# EAGLE design tres_chepes (EAGLE 6.5.0)
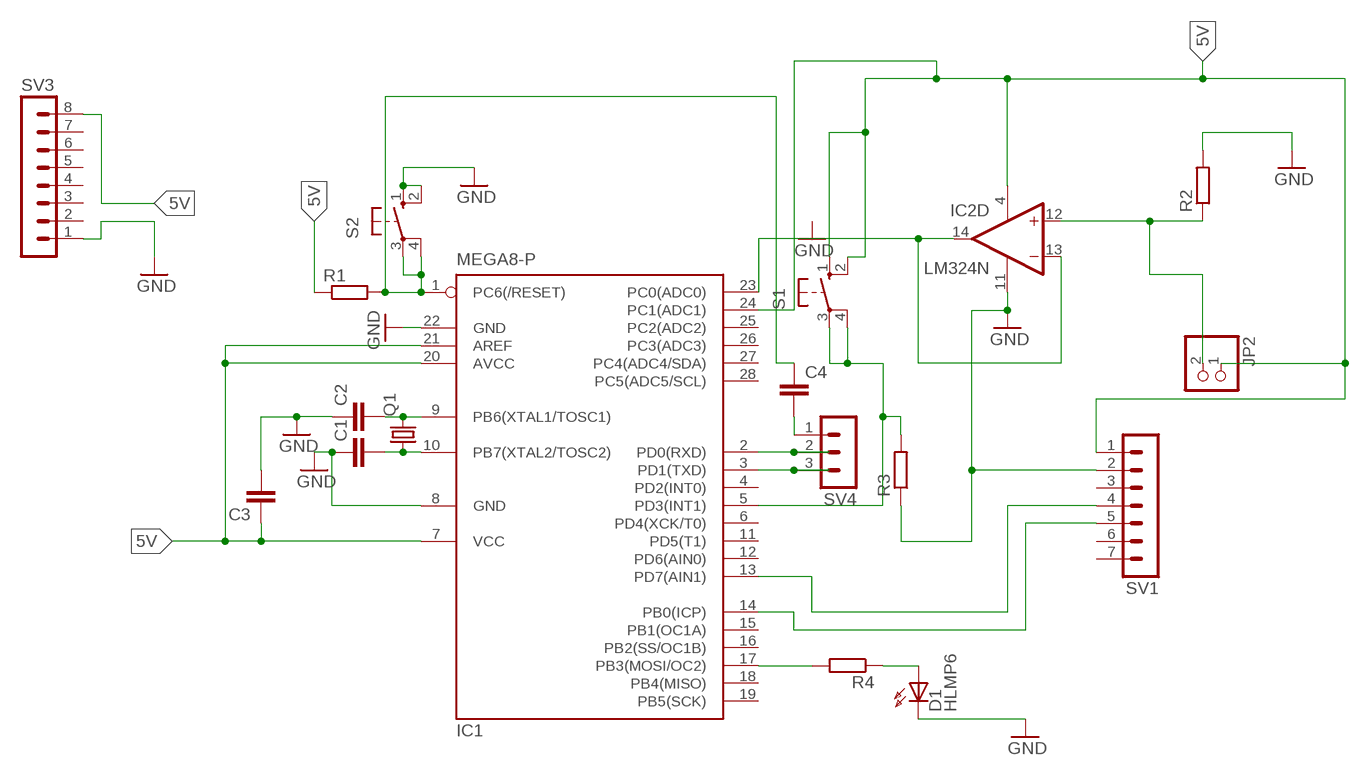
[diagram p0: schematic, sheet 1]

## Parts
C1  C2,5-3  [C2.5-3]
C2  C2,5-3  [C2.5-3]
C3  C2,5-3  [C2.5-3]
C4  C-EU025-024X044  [C025-024X044]
D1  HLMP6  [HLMP6]
IC1  MEGA8-P  [DIL28-3]
IC2  LM324N  [DIL14]
JP2  PINHD-1X2  [1X02]
Q1  CRYSTALTC26V  [TC26V]
R1  R-EU_0204/5  [0204/5]
R2  R-EU_0204/5  [0204/5]
R3  R-EU_0204/5  [0204/5]
R4  R-EU_0204/5  [0204/5]
S1  10-XX  [B3F-10XX]
S2  10-XX  [B3F-10XX]
SV1  MA07-1  [MA07-1]
SV3  MA08-1W  [MA08-1W]
SV4  MA03-1  [MA03-1]

## Nets
5V: C3.1 IC1.7(VCC) IC1.20(AVCC) IC1.21(AREF) IC1.24(PC1(ADC1)) IC2.4(P:V+) JP2.1 R1.1 S1.1(S) S1.2(S1) SV1.1 SV3.8
GND: C1.1 C2.1 C3.2 D1.K IC1.8(GND) IC1.22(GND) IC2.11(P:V-) R2.2 R3.1 S2.1(S) S2.2(S1) SV1.2 SV3.1
N$1: IC2.12(D:+IN) JP2.2 R2.1
N$2: C4.2 SV4.1
N$3: IC1.17(PB3(MOSI/OC2)) R4.2
N$4: IC1.5(PD3(INT1)) R3.2 S1.3(P) S1.4(P1)
N$5: IC1.3(PD1(TXD)) SV4.3
N$6: D1.A R4.1
N$7: IC1.2(PD0(RXD)) SV4.2
N$11: IC1.13(PD7(AIN1)) SV1.4
N$12: IC1.14(PB0(ICP)) SV1.5
N$14: C2.2 IC1.9(PB6(XTAL1/TOSC1)) Q1.2
N$15: C1.2 IC1.10(PB7(XTAL2/TOSC2)) Q1.1
N$16: C4.1 IC1.1(PC6(/RESET)) R1.2 S2.3(P) S2.4(P1)
N$18: IC1.23(PC0(ADC0)) IC2.13(D:-IN) IC2.14(D:OUT)
Unconnected: IC1.4(PD2(INT0)) IC1.6(PD4(XCK/T0)) IC1.11(PD5(T1)) IC1.12(PD6(AIN0)) IC1.15(PB1(OC1A)) IC1.16(PB2(SS/OC1B)) IC1.18(PB4(MISO)) IC1.19(PB5(SCK)) IC1.25(PC2(ADC2)) IC1.26(PC3(ADC3)) IC1.27(PC4(ADC4/SDA)) IC1.28(PC5(ADC5/SCL)) IC2.1(A:OUT) IC2.2(A:-IN) IC2.3(A:+IN) IC2.5(B:+IN) IC2.6(B:-IN) IC2.7(B:OUT) IC2.8(C:OUT) IC2.9(C:-IN) IC2.10(C:+IN) SV1.3 SV1.6 SV1.7 SV3.2 SV3.3 SV3.4 SV3.5 SV3.6 SV3.7

## Library data of the parts
C1-C3 = capacitor-wima:C: CAPACITOR naming: grid - package width
C4 = rcl:C-EU: CAPACITOR, European symbol
D1 = display-hp:HLMP6: LED 2mm horizontal; MF: AGILENT TECHNOLOGIES; MPN: HLMP-6500; OC_FARNELL: 1652490; OC_NEWARK: 40K0088
IC1 = atmel:MEGA8-P: MICROCONTROLLER 8 Kbytes FLASH, 1 kbytes SRAM, 512 bytes EEPROM, USART, 4-channel 10 bit ADC, 2-channel 8 bit ADC Pin compatible with Atmega48, ATMega88, ATMega168 Source: avr.lbr; OC_FARNELL: unknown; OC_NEWARK: unknown
IC2 = linear:LM324: OP AMP
JP2 = pinhead:PINHD-1X2: PIN HEADER
Q1 = crystal:CRYSTAL: CRYSTAL; OC_FARNELL: unknown; OC_NEWARK: unknown
R1-R4 = rcl:R-EU_: RESISTOR, European symbol
S1 S2 = switch-omron:10-XX: OMRON SWITCH; MPN: B3F-1000; OC_FARNELL: 176432; OC_NEWARK: 36M3542
SV1 = con-lstb:MA07-1: PIN HEADER; OC_FARNELL: unknown; OC_NEWARK: unknown
SV3 = con-lstb:MA08-1W: PIN HEADER; OC_FARNELL: unknown; OC_NEWARK: unknown
SV4 = con-lstb:MA03-1: PIN HEADER; OC_FARNELL: unknown; OC_NEWARK: unknown

## Board
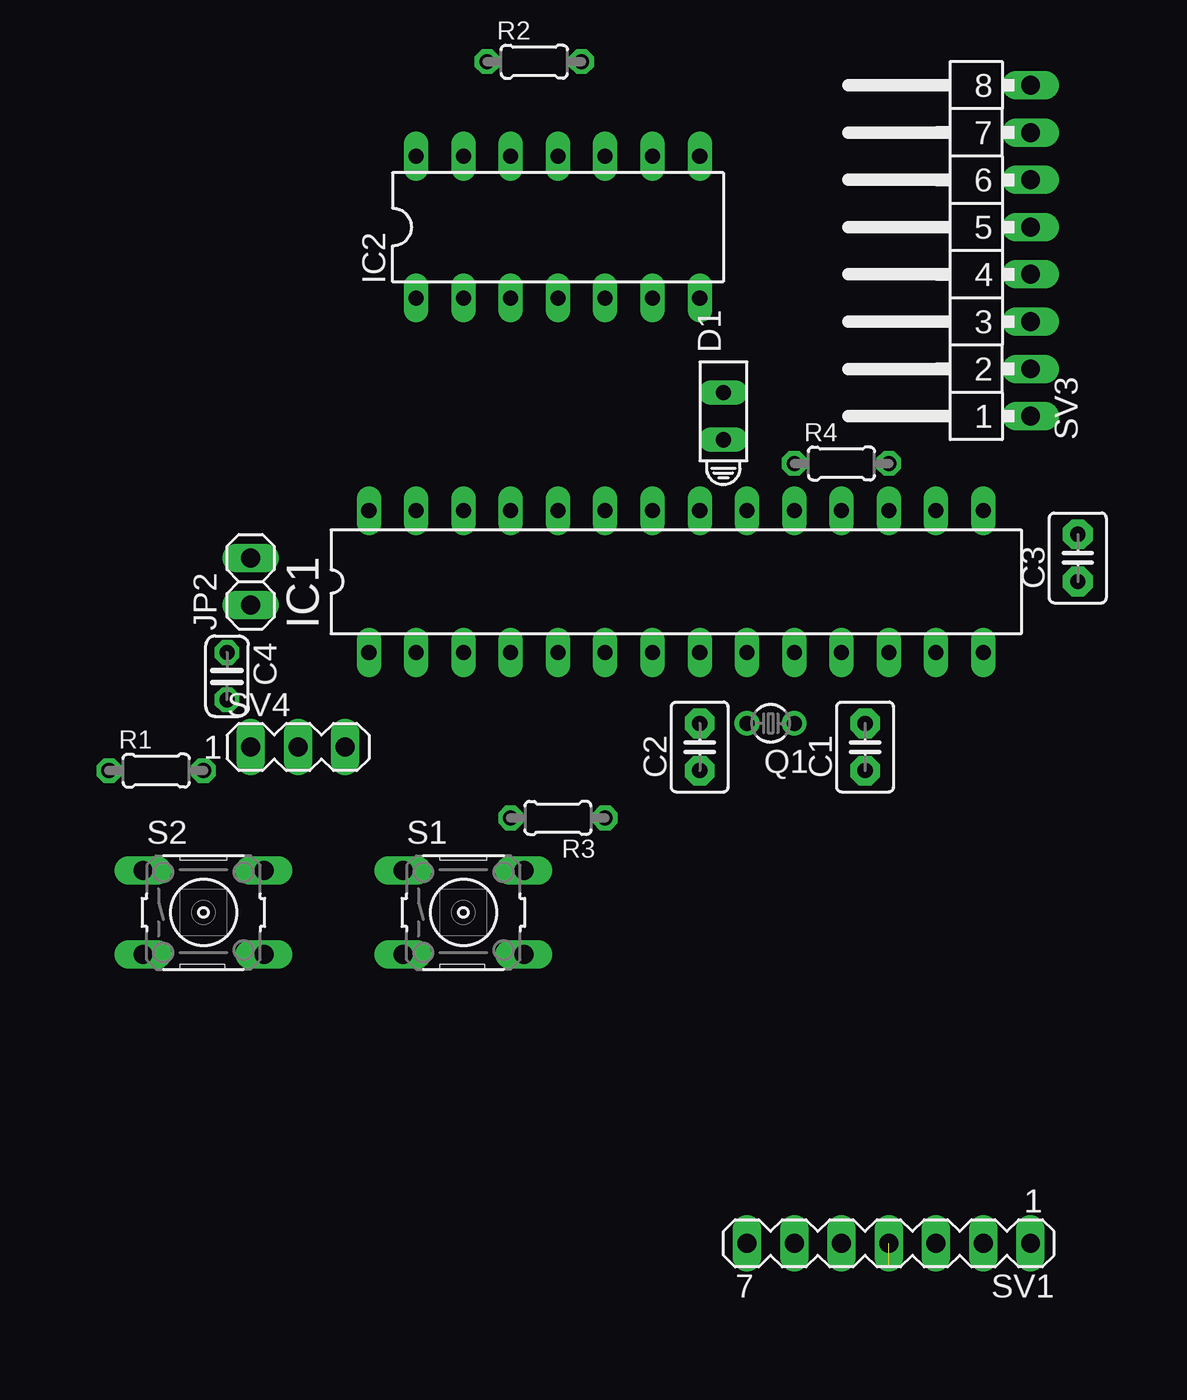
[diagram p1: board, top side]
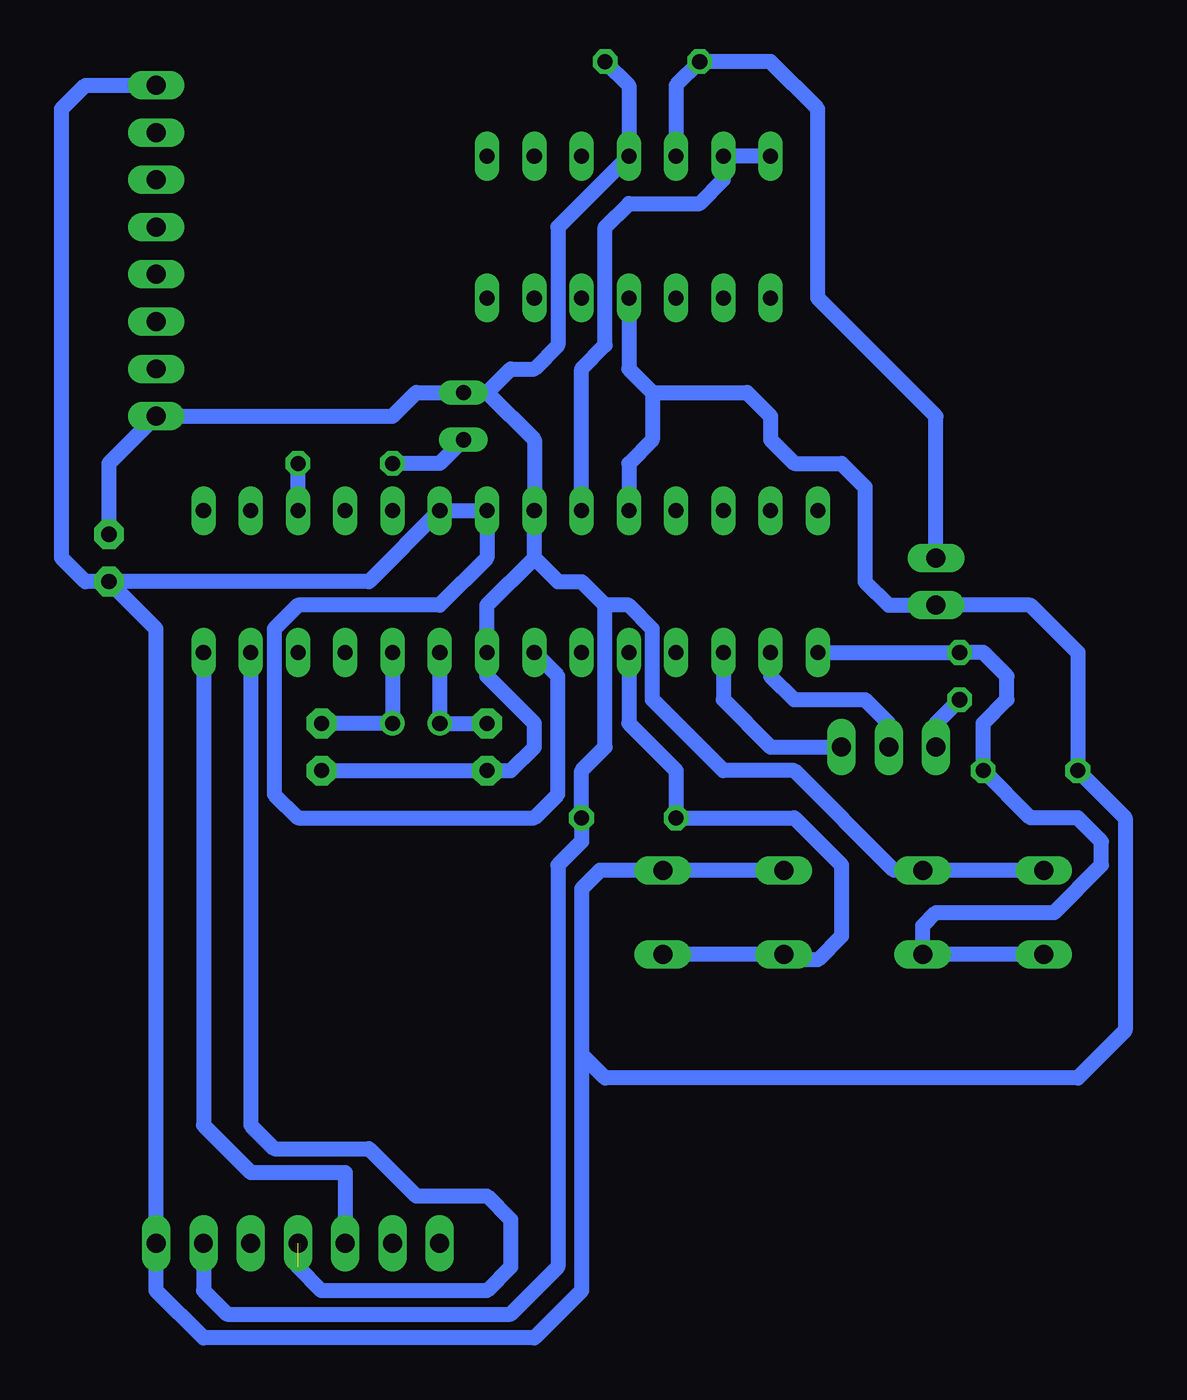
[diagram p2: board, bottom side, seen from below]

No outline drawn. Coordinates in mm, seen from the top.
Copper layers (1*16): Top 0.035mm / dielectric 1.5mm / Bottom 0.035mm
Design rules "default": minimum track width 10mil, minimum drill 24mil, track to track 8mil, track to pad 8mil, pad to pad 8mil, via to via 8mil, smd to smd 8mil, copper to edge 40mil, drill to drill 8mil, minimum pad ring 10mil, minimum via ring 8mil, stop-mask expansion 4mil, vias tented up to drill 0mil, thermal gap 10mil

### Footprints (pad centres in the part's own frame; a part is rotated, then mirrored left to right if it is on the bottom)
C2.5-3 = drill 0.813 pad 1.6 octagon: 1 -1.27,0; 2 1.27,0
C025-024X044 = drill 0.813 octagon: 1 -1.27,0; 2 1.27,0
HLMP6 = drill 0.813 long: A -1.27,0; K 1.27,0
DIL28-3 = drill 0.813 long: 1 -16.51,-3.81; 2 -13.97,-3.81; 3 -11.43,-3.81; 4 -8.89,-3.81; 5 -6.35,-3.81; 6 -3.81,-3.81; 7 -1.27,-3.81; 8 1.27,-3.81; 9 3.81,-3.81; 10 6.35,-3.81; 11 8.89,-3.81; 12 11.43,-3.81; 13 13.97,-3.81; 14 16.51,-3.81; 15 16.51,3.81; 16 13.97,3.81; 17 11.43,3.81; 18 8.89,3.81; 19 6.35,3.81; 20 3.81,3.81; 21 1.27,3.81; 22 -1.27,3.81; 23 -3.81,3.81; 24 -6.35,3.81; 25 -8.89,3.81; 26 -11.43,3.81; 27 -13.97,3.81; 28 -16.51,3.81
DIL14 = drill 0.813 long: 1 -7.62,-3.81; 2 -5.08,-3.81; 3 -2.54,-3.81; 4 0,-3.81; 5 2.54,-3.81; 6 5.08,-3.81; 7 7.62,-3.81; 8 7.62,3.81; 9 5.08,3.81; 10 2.54,3.81; 11 0,3.81; 12 -2.54,3.81; 13 -5.08,3.81; 14 -7.62,3.81
1X02 = drill 1.016 long: 1 -1.27,0; 2 1.27,0
TC26V = drill 0.813: 1 -1.27,0; 2 1.27,0
0204/5 = drill 0.813 octagon: 1 -2.54,0; 2 2.54,0
B3F-10XX = drill 1.016 long: 1 -3.251,2.261; 2 3.251,2.261; 3 -3.251,-2.261; 4 3.251,-2.261
MA07-1 = drill 1.016 long: 1 -7.62,0; 2 -5.08,0; 3 -2.54,0; 4 0,0; 5 2.54,0; 6 5.08,0; 7 7.62,0
MA08-1W = drill 1.016 long: 1 -8.89,0; 2 -6.35,0; 3 -3.81,0; 4 -1.27,0; 5 1.27,0; 6 3.81,0; 7 6.35,0; 8 8.89,0
MA03-1 = drill 1.016 long: 1 -2.54,0; 2 0,0; 3 2.54,0

### Placement (x,y rotation side)
C1  40.64,27.94 90 top
C2  31.75,27.94 90 top
C3  52.07,38.1 90 top
C4  6.35,31.75 270 top
D1  33.02,45.72 90 top
IC1  30.48,36.83 0 top
IC2  24.13,55.88 0 top
JP2  7.62,36.83 90 top
Q1  35.56,29.21 180 top
R1  2.54,26.67 0 top
R2  22.86,64.77 0 top
R3  24.13,24.13 180 top
R4  39.37,43.18 0 top
S1  19.05,19.05 0 top
S2  5.08,19.05 0 top
SV1  41.91,1.27 180 top
SV3  49.53,54.61 90 top
SV4  10.16,27.94 0 top

### Tracks (layer width: path | path; a pad name or v marks a point on that pad's centre or on a via)
5V
  Bottom 0.813: C3.1 38.1,36.83 IC1.20 IC1.21 31.75,38.1 34.29,35.56 41.91,35.56 43.18,34.29 43.18,25.4 41.91,24.13 29.21,24.13 27.94,25.4 27.94,31.75 IC1.7 | C3.1 53.34,36.83 54.61,38.1 54.61,62.23 53.34,63.5 SV3.8 | IC2.4 24.13,48.26 22.86,46.99 | C3.1 49.53,34.29 SV1.1 49.53,-1.27 46.99,-3.81 29.21,-3.81 26.67,-1.27 26.67,11.43 | 26.67,11.43 26.67,20.32 25.68,21.31 S1.2 S1.1 | 26.67,11.43 25.4,10.16 0,10.16 -2.54,12.7 -2.54,24.13 R1.1 0,33.02 2.54,35.56 JP2.1 10.16,35.56 11.43,36.83 11.43,41.91 12.7,43.18 15.24,43.18 16.51,44.45 16.51,45.72 17.78,46.99 22.86,46.99 | 22.86,46.99 22.86,44.45 24.13,43.18 IC1.24
GND
  Bottom 0.813: R2.2 24.13,63.5 IC2.11 27.94,55.88 27.94,49.53 29.21,48.26 30.48,48.26 31.75,46.99 | C3.2 52.07,43.18 SV3.1 36.83,45.72 35.56,46.99 D1.K 31.75,46.99 | 29.21,38.1 IC1.22 29.21,44.45 31.75,46.99 | C1.1 C2.1 30.48,26.67 29.21,27.94 29.21,29.21 31.75,31.75 IC1.8 31.75,35.56 29.21,38.1 | 29.21,38.1 27.94,36.83 26.67,36.83 25.4,35.56 | SV1.2 46.99,-1.27 45.72,-2.54 30.48,-2.54 27.94,0 27.94,21.59 26.67,22.86 R3.1 26.67,26.67 25.4,27.94 25.4,35.56 | 25.4,35.56 24.13,35.56 22.86,34.29 22.86,30.48 19.05,26.67 15.24,26.67 9.88,21.31 S2.2 S2.1
N$1
  Bottom 0.813: IC2.12 21.59,63.5 R2.1 16.51,64.77 13.97,62.23 13.97,52.07 7.62,45.72 JP2.2
N$2
  Bottom 0.813: SV4.1 7.62,29.21 C4.2
N$3
  Bottom 0.813: IC1.17 R4.2
N$4
  Bottom 0.813: IC1.5 24.13,29.21 21.59,26.67 R3.2 15.24,24.13 12.7,21.59 12.7,17.78 13.97,16.51 15.52,16.51 S1.3 S1.4
N$5
  Bottom 0.813: IC1.3 19.05,30.48 16.51,27.94 SV4.3
N$6
  Bottom 0.813: D1.A 34.29,43.18 R4.1
N$7
  Bottom 0.813: IC1.2 16.51,31.75 15.24,30.48 11.43,30.48 10.16,29.21 SV4.2
N$11  (1 unrouted)
  Bottom 0.813: IC1.13 44.45,7.62 43.18,6.35 38.1,6.35 35.56,3.81 31.75,3.81 30.48,2.54 30.48,0 31.75,-1.27 40.64,-1.27 41.91,0
N$12
  Bottom 0.813: IC1.14 46.99,7.62 44.45,5.08 39.37,5.08 SV1.5
N$14
  Bottom 0.813: IC1.9 Q1.2 C2.2
N$15
  Bottom 0.813: IC1.10 Q1.1 C1.2
N$16
  Bottom 0.813: S2.3 S2.4 8.33,18.34 7.62,19.05 1.27,19.05 -1.27,21.59 -1.27,22.86 0,24.13 2.54,24.13 R1.2 5.08,29.21 3.81,30.48 3.81,31.75 5.08,33.02 C4.1 IC1.1
N$18
  Bottom 0.813: IC1.23 26.67,48.26 25.4,49.53 25.4,55.88 24.13,57.15 20.32,57.15 19.05,58.42 IC2.13 IC2.14